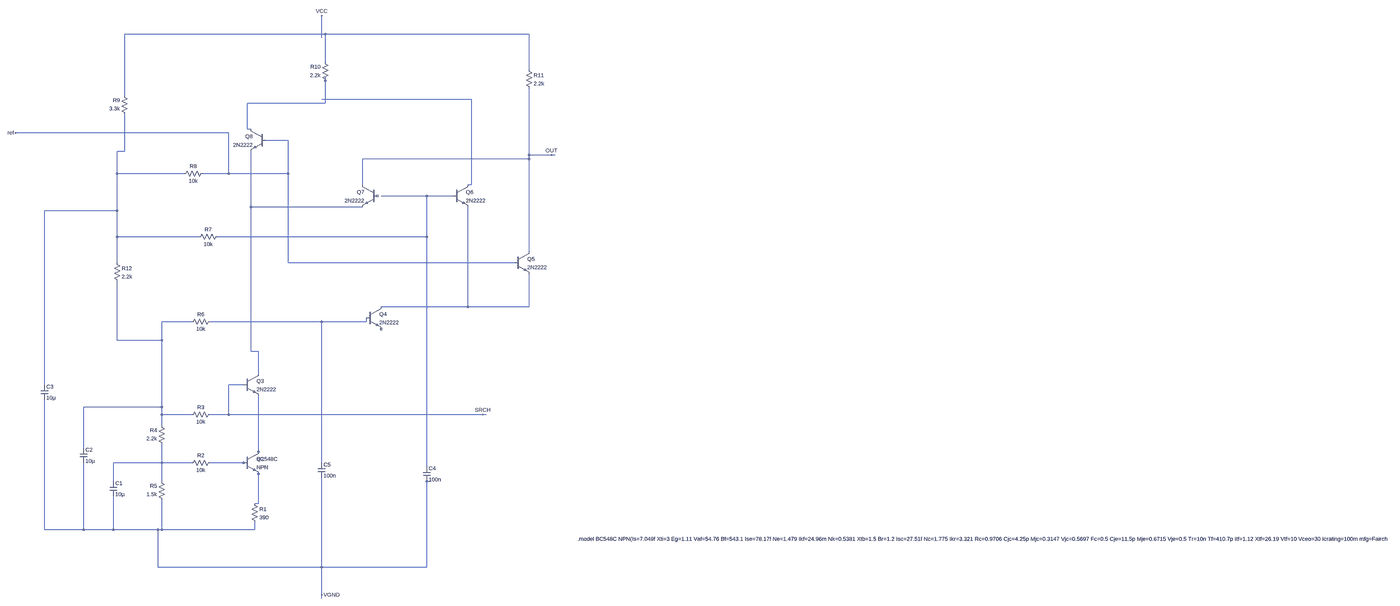
[diagram p0: schematic gilberCell.asc, whole sheet]
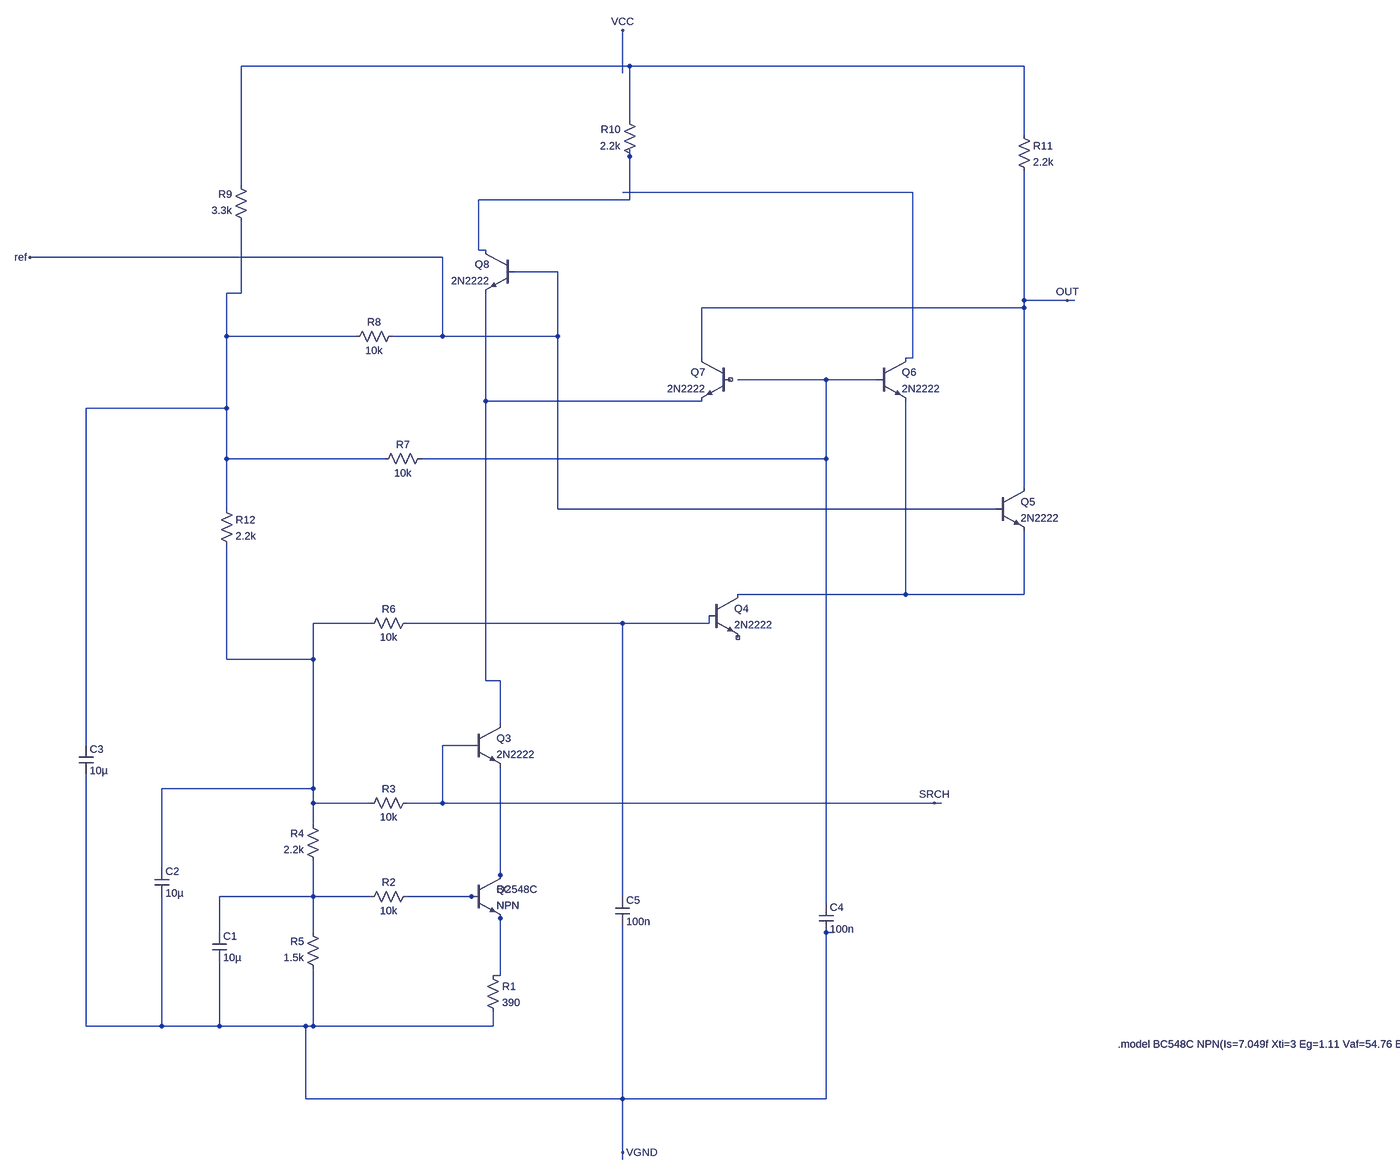
[diagram p1: schematic gilberCell.asc, part, row 1 of 1, column 1 of 2]
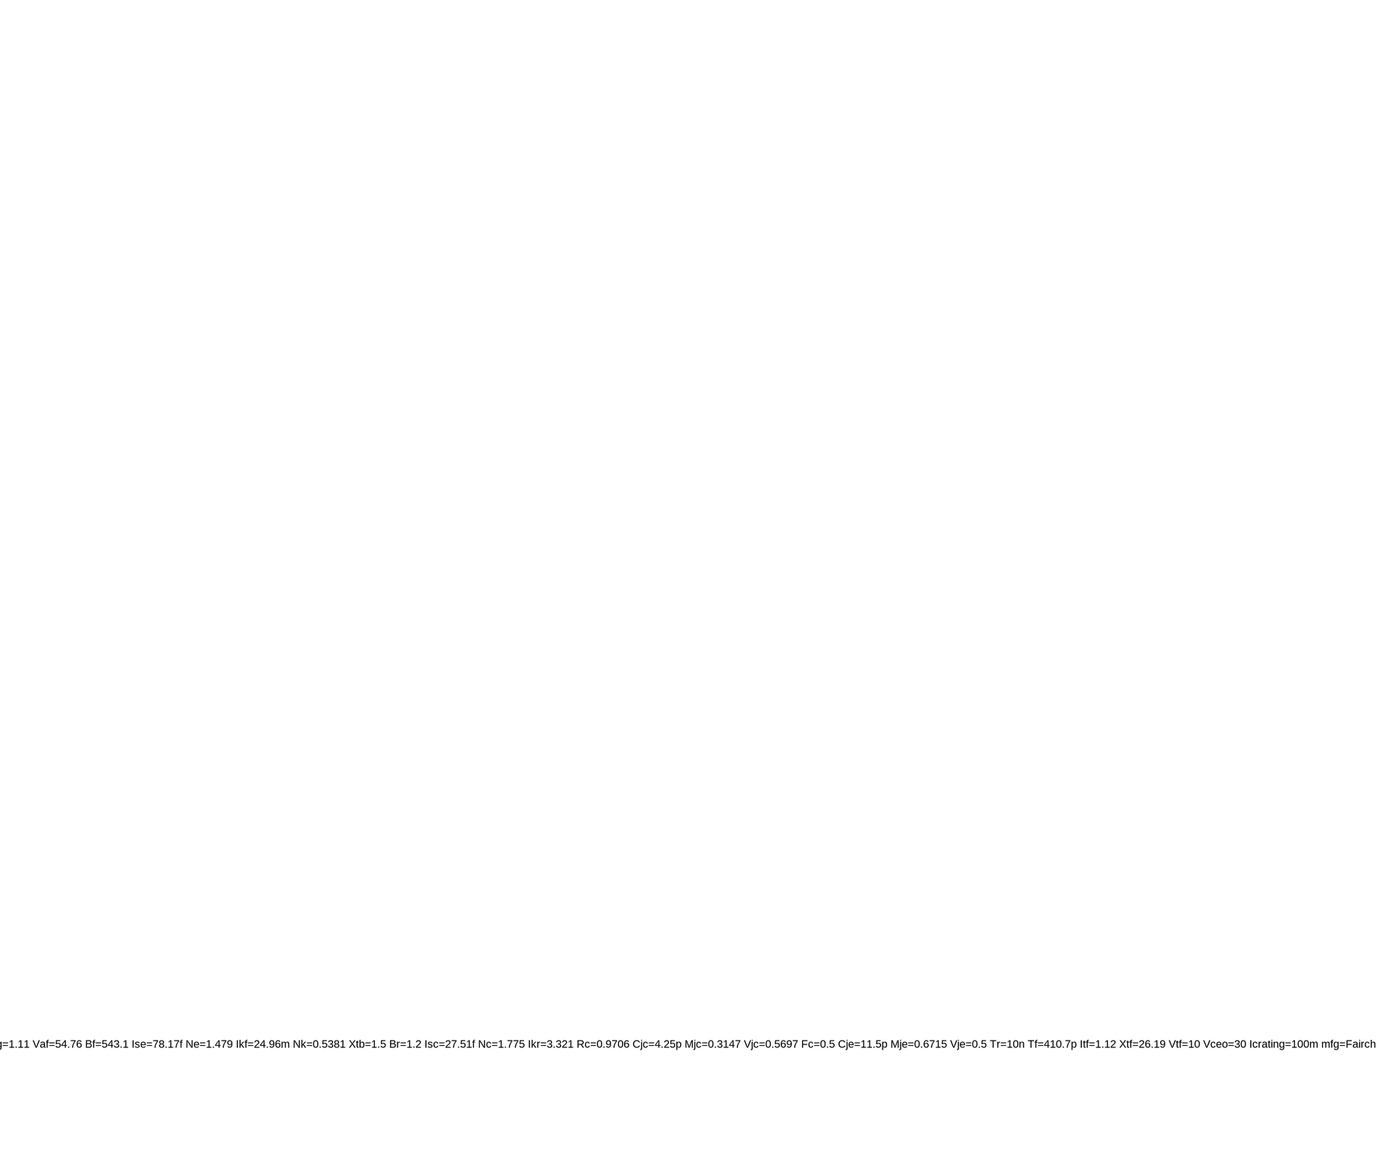
[diagram p2: schematic gilberCell.asc, part, row 1 of 1, column 2 of 2]
gilberCell.asc, the LTspice schematic file:
Version 4.1
SHEET 1 5616 1056
WIRE 496 -1648 -368 -1648
WIRE 1456 -1648 496 -1648
WIRE 480 -1632 480 -1728
WIRE 496 -1392 496 -1648
WIRE 1456 -1360 1456 -1648
WIRE 496 -1312 496 -1328
WIRE -368 -1248 -368 -1648
WIRE 1168 -1232 480 -1232
WIRE 496 -1216 496 -1312
WIRE 496 -1216 160 -1216
WIRE 160 -1104 160 -1216
WIRE 176 -1104 160 -1104
WIRE 80 -1088 -1104 -1088
WIRE 336 -1056 240 -1056
WIRE -368 -1008 -368 -1168
WIRE -368 -1008 -400 -1008
WIRE 1456 -992 1456 -1280
WIRE 1552 -992 1456 -992
WIRE 1568 -992 1552 -992
WIRE 1456 -976 1456 -992
WIRE 1456 -976 656 -976
WIRE -400 -912 -400 -1008
WIRE -112 -912 -400 -912
WIRE 80 -912 80 -1088
WIRE 80 -912 -32 -912
WIRE 336 -912 336 -1056
WIRE 336 -912 80 -912
WIRE 656 -864 656 -976
WIRE 1168 -864 1168 -1232
WIRE 1168 -864 1152 -864
WIRE 976 -816 736 -816
WIRE 1088 -816 976 -816
WIRE 176 -768 176 -1008
WIRE 656 -768 176 -768
WIRE -400 -752 -400 -912
WIRE -400 -752 -784 -752
WIRE -400 -640 -400 -752
WIRE -48 -640 -400 -640
WIRE 976 -640 976 -816
WIRE 976 -640 32 -640
WIRE 1456 -576 1456 -976
WIRE -400 -528 -400 -640
WIRE 336 -528 336 -912
WIRE 1392 -528 336 -528
WIRE 1152 -320 1152 -768
WIRE 1152 -320 736 -320
WIRE 1456 -320 1456 -480
WIRE 1456 -320 1152 -320
WIRE -80 -256 -208 -256
WIRE 480 -256 0 -256
WIRE 672 -256 672 -272
WIRE 672 -256 480 -256
WIRE -400 -176 -400 -448
WIRE -208 -176 -208 -256
WIRE -208 -176 -400 -176
WIRE 176 -128 176 -768
WIRE 208 -128 176 -128
WIRE 208 -32 208 -128
WIRE -784 16 -784 -752
WIRE 144 16 80 16
WIRE -208 112 -208 -176
WIRE -208 112 -544 112
WIRE -208 144 -208 112
WIRE -80 144 -208 144
WIRE 80 144 80 16
WIRE 80 144 0 144
WIRE 1216 144 80 144
WIRE 1232 144 1216 144
WIRE -208 192 -208 144
WIRE -544 288 -544 112
WIRE 208 304 208 64
WIRE -208 352 -208 272
WIRE -208 352 -416 352
WIRE -80 352 -208 352
WIRE 144 352 0 352
WIRE 160 352 144 352
WIRE 480 352 480 -256
WIRE 976 368 976 -640
WIRE -416 432 -416 352
WIRE -208 432 -208 352
WIRE 992 432 976 432
WIRE 208 528 208 400
WIRE 208 528 192 528
WIRE -784 640 -784 80
WIRE -544 640 -544 352
WIRE -544 640 -784 640
WIRE -416 640 -416 496
WIRE -416 640 -544 640
WIRE -224 640 -416 640
WIRE -208 640 -208 512
WIRE -208 640 -224 640
WIRE 192 640 192 608
WIRE 192 640 -208 640
WIRE -224 832 -224 640
WIRE 480 832 480 416
WIRE 480 832 -224 832
WIRE 976 832 976 432
WIRE 976 832 480 832
WIRE 480 976 480 832
WIRE 480 992 480 976
FLAG 1552 -992 OUT
FLAG 1216 144 SRCH
FLAG -1104 -1088 ref
FLAG 480 -1728 VCC
FLAG 480 976 VGND
SYMBOL npn 144 304 R0
SYMATTR InstName BC548C
SYMBOL npn 144 304 R0
SYMATTR InstName Q2
SYMBOL npn 144 -32 R0
SYMATTR InstName Q3
SYMATTR Value 2N2222
SYMBOL npn 672 -320 R0
SYMATTR InstName Q4
SYMATTR Value 2N2222
SYMBOL npn 1392 -576 R0
SYMATTR InstName Q5
SYMATTR Value 2N2222
SYMBOL npn 1088 -864 R0
SYMATTR InstName Q6
SYMATTR Value 2N2222
SYMBOL npn 720 -864 M0
SYMATTR InstName Q7
SYMATTR Value 2N2222
SYMBOL npn 240 -1104 M0
SYMATTR InstName Q8
SYMATTR Value 2N2222
SYMBOL res 176 512 R0
SYMATTR InstName R1
SYMATTR Value 390
SYMBOL res 16 336 R90
WINDOW 0 0 56 VBottom 2
WINDOW 3 32 56 VTop 2
SYMATTR InstName R2
SYMATTR Value 10k
SYMBOL res 16 128 R90
WINDOW 0 0 56 VBottom 2
WINDOW 3 32 56 VTop 2
SYMATTR InstName R3
SYMATTR Value 10k
SYMBOL res -192 288 R180
WINDOW 0 36 76 Left 2
WINDOW 3 36 40 Left 2
SYMATTR InstName R4
SYMATTR Value 2.2k
SYMBOL res -192 528 R180
WINDOW 0 36 76 Left 2
WINDOW 3 36 40 Left 2
SYMATTR InstName R5
SYMATTR Value 1.5k
SYMBOL res 16 -272 R90
WINDOW 0 0 56 VBottom 2
WINDOW 3 32 56 VTop 2
SYMATTR InstName R6
SYMATTR Value 10k
SYMBOL res 48 -656 R90
WINDOW 0 0 56 VBottom 2
WINDOW 3 32 56 VTop 2
SYMATTR InstName R7
SYMATTR Value 10k
SYMBOL res -16 -928 R90
WINDOW 0 0 56 VBottom 2
WINDOW 3 32 56 VTop 2
SYMATTR InstName R8
SYMATTR Value 10k
SYMBOL res -352 -1152 R180
WINDOW 0 36 76 Left 2
WINDOW 3 36 40 Left 2
SYMATTR InstName R9
SYMATTR Value 3.3k
SYMBOL res 512 -1296 R180
WINDOW 0 36 76 Left 2
WINDOW 3 36 40 Left 2
SYMATTR InstName R10
SYMATTR Value 2.2k
SYMBOL res -416 -544 R0
SYMATTR InstName R12
SYMATTR Value 2.2k
SYMBOL cap -432 432 R0
SYMATTR InstName C1
SYMATTR Value 10µ
SYMBOL cap -560 288 R0
SYMATTR InstName C2
SYMATTR Value 10µ
SYMBOL cap -800 16 R0
SYMATTR InstName C3
SYMATTR Value 10µ
SYMBOL res 1440 -1376 R0
SYMATTR InstName R11
SYMATTR Value 2.2k
SYMBOL cap 960 368 R0
SYMATTR InstName C4
SYMATTR Value 100n
SYMBOL cap 464 352 R0
SYMATTR InstName C5
SYMATTR Value 100n
TEXT 1664 680 Left 2 !.model BC548C NPN(Is=7.049f Xti=3 Eg=1.11 Vaf=54.76 Bf=543.1 Ise=78.17f Ne=1.479 Ikf=24.96m Nk=0.5381 Xtb=1.5 Br=1.2 Isc=27.51f Nc=1.775 Ikr=3.321 Rc=0.9706 Cjc=4.25p Mjc=0.3147 Vjc=0.5697 Fc=0.5 Cje=11.5p Mje=0.6715 Vje=0.5 Tr=10n Tf=410.7p Itf=1.12 Xtf=26.19 Vtf=10 Vceo=30 Icrating=100m mfg=Fairchild)

The netlist it stands for:
* gilberCell.asc
Q§BC548C N010 N012 N013 0 NPN
Q2 N010 N012 N013 0 NPN
Q3 N006 SRCH N010 0 2N2222
Q4 N007 N009 NC_01 0 2N2222
Q5 OUT ref N007 0 2N2222
Q6 N003 N005 N007 0 2N2222
Q7 OUT NC_02 N006 0 2N2222
Q8 N002 ref N006 0 2N2222
R1 N013 VGND 390
R2 N012 N011 10k
R3 SRCH N008 10k
R4 N011 N008 2.2k
R5 VGND N011 1.5k
R6 N009 N008 10k
R7 N005 N004 10k
R8 ref N004 10k
R9 N004 N001 3.3k
R10 N002 N001 2.2k
R12 N004 N008 2.2k
C1 N011 VGND 10µ
C2 N008 VGND 10µ
C3 N004 VGND 10µ
R11 N001 OUT 2.2k
C4 N005 VGND 100n
C5 N009 VGND 100n
.model NPN NPN
.model PNP PNP
.lib standard.bjt
.model BC548C NPN(Is=7.049f Xti=3 Eg=1.11 Vaf=54.76 Bf=543.1 Ise=78.17f Ne=1.479 Ikf=24.96m Nk=0.5381 Xtb=1.5 Br=1.2 Isc=27.51f Nc=1.775 Ikr=3.321 Rc=0.9706 Cjc=4.25p Mjc=0.3147 Vjc=0.5697 Fc=0.5 Cje=11.5p Mje=0.6715 Vje=0.5 Tr=10n Tf=410.7p Itf=1.12 Xtf=26.19 Vtf=10 Vceo=30 Icrating=100m mfg=Fairchild)
.backanno
.end